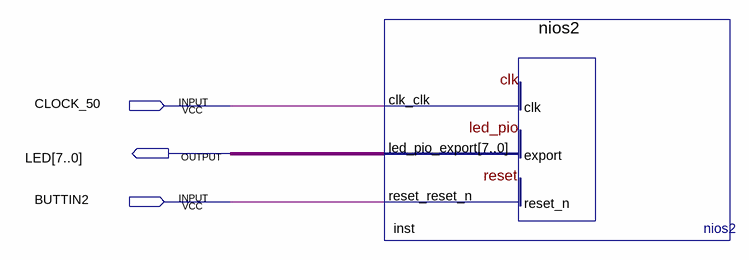
[diagram p0: schematic sheet]
// Quartus schematic Nios_top.bdf as structural Verilog: 1 symbols, 3 pins
module Nios_top (
  input  CLOCK_50,
  input  BUTTIN2,
  output [7:0] LED
);

  nios2 inst (.clk_clk(CLOCK_50), .reset_reset_n(BUTTIN2), .led_pio_export(LED));
endmodule
